# EAGLE design 9DofImu (EAGLE 7.5.0)

## Sheet 1 of 2
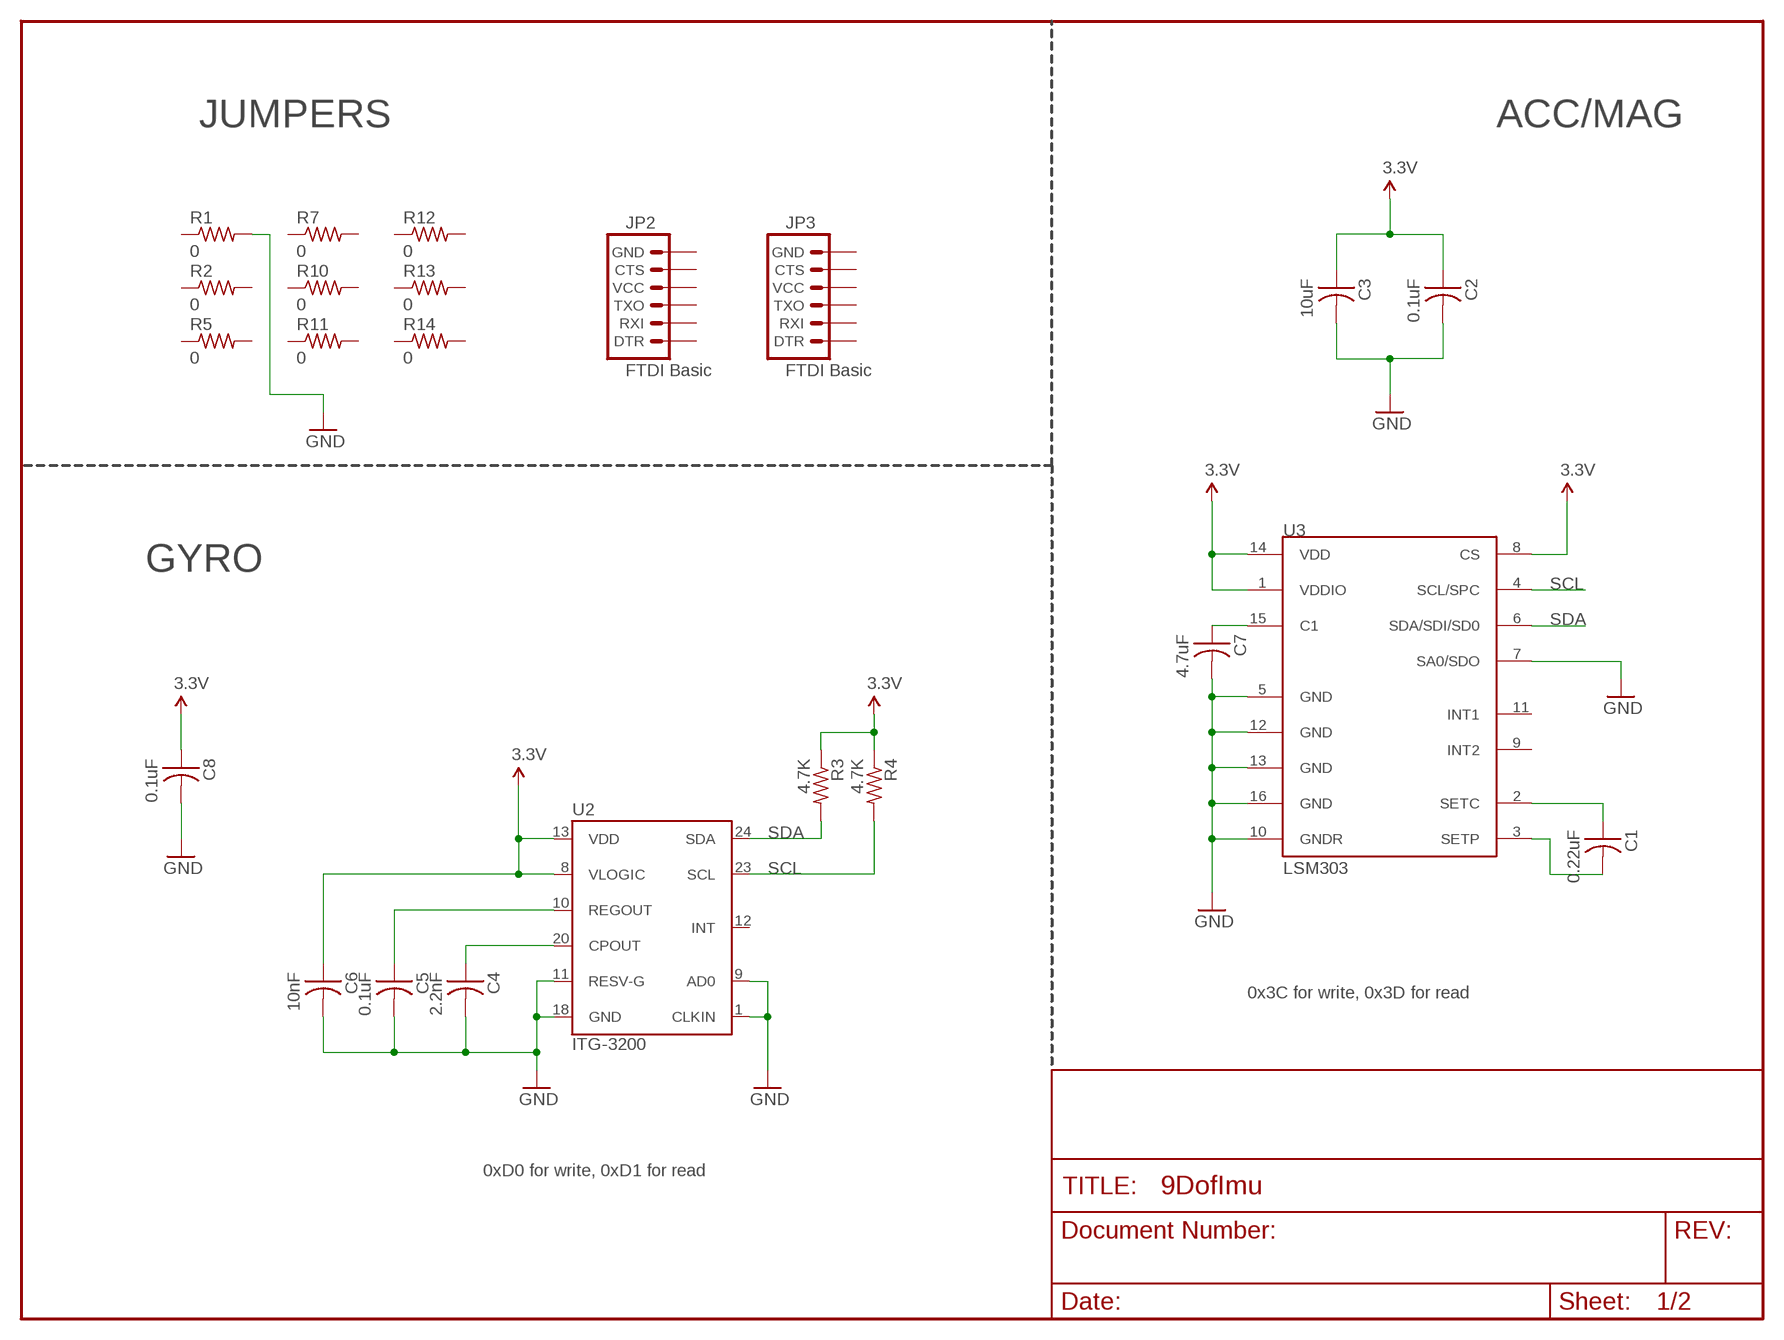
[diagram p0: schematic, sheet 1]

### Parts
C1  0.22uF  CAP-US1206  [C1206]
C2  0.1uF  CAP-US1206  [C1206]
C3  10uF  CAP-US1206  [C1206]
C4  2.2nF  CAP-US1206  [C1206]
C5  0.1uF  CAP-US1206  [C1206]
C6  10nF  CAP-US1206  [C1206]
C7  4.7uF  CAP-US1206  [C1206]
C8  0.1uF  CAP-US1206  [C1206]
JP2  FTDI Basic  ARDUINO_SERIAL_PROGRAMPTH-KIT  [1X06-KIT]
JP3  FTDI Basic  ARDUINO_SERIAL_PROGRAMPTH-KIT  [1X06-KIT]
R1  0  RES-US1206FAB  [R1206FAB]
R2  0  RES-US1206FAB  [R1206FAB]
R3  4.7K  RES-US1206  [R1206]
R4  4.7K  RES-US1206FAB  [R1206FAB]
R5  0  RES-US1206FAB  [R1206FAB]
R7  0  RES-US1206FAB  [R1206FAB]
R10  0  RES-US1206FAB  [R1206FAB]
R11  0  RES-US1206FAB  [R1206FAB]
R12  0  RES-US1206FAB  [R1206FAB]
R13  0  RES-US1206FAB  [R1206FAB]
R14  0  RES-US1206FAB  [R1206FAB]
U2  ITG-3200  [QFN-24]
U3  LSM303  [LGA16-3MM]

### Nets
3.3V: C2.1 C3.1 C6.1 C8.1 R3.1 R4.1 U2.8(VLOGIC) U2.13(VDD) U3.1(VDDIO) U3.8(CS) U3.14(VDD) ; also sheet 2
GND: C2.2 C3.2 C4.2 C5.2 C6.2 C7.2 C8.2 R1.2 U2.1(CLKIN) U2.9(AD0) U2.11(RESV-G) U2.18(GND) U3.5(GND) U3.7(SA0/SDO) U3.10(GNDR) U3.12(GND) U3.13(GND) U3.16(GND) ; also sheet 2
N$1: C4.1 U2.20(CPOUT)
N$2: C5.1 U2.10(REGOUT)
N$3: C7.1 U3.15(C1)
N$4: C1.1 U3.2(SETC)
N$5: C1.2 U3.3(SETP)
SCL: R4.2 U2.23(SCL) U3.4(SCL/SPC) ; also sheet 2
SDA: R3.2 U2.24(SDA) U3.6(SDA/SDI/SD0) ; also sheet 2
Unconnected: JP2.1(DTR) JP2.2(RXI) JP2.3(TXO) JP2.4(VCC) JP2.5(CTS) JP2.6(GND) JP3.1(DTR) JP3.2(RXI) JP3.3(TXO) JP3.4(VCC) JP3.5(CTS) JP3.6(GND) R1.1 R2.1 R2.2 R5.1 R5.2 R7.1 R7.2 R10.1 R10.2 R11.1 R11.2 R12.1 R12.2 R13.1 R13.2 R14.1 R14.2 U2.12(INT) U3.9(INT2) U3.11(INT1)

### Notes on the sheet
- JUMPERS | ACC/MAG
- GYRO
- 0x3C for write, 0x3D for read
- 0xD0 for write, 0xD1 for read

## Sheet 2 of 2
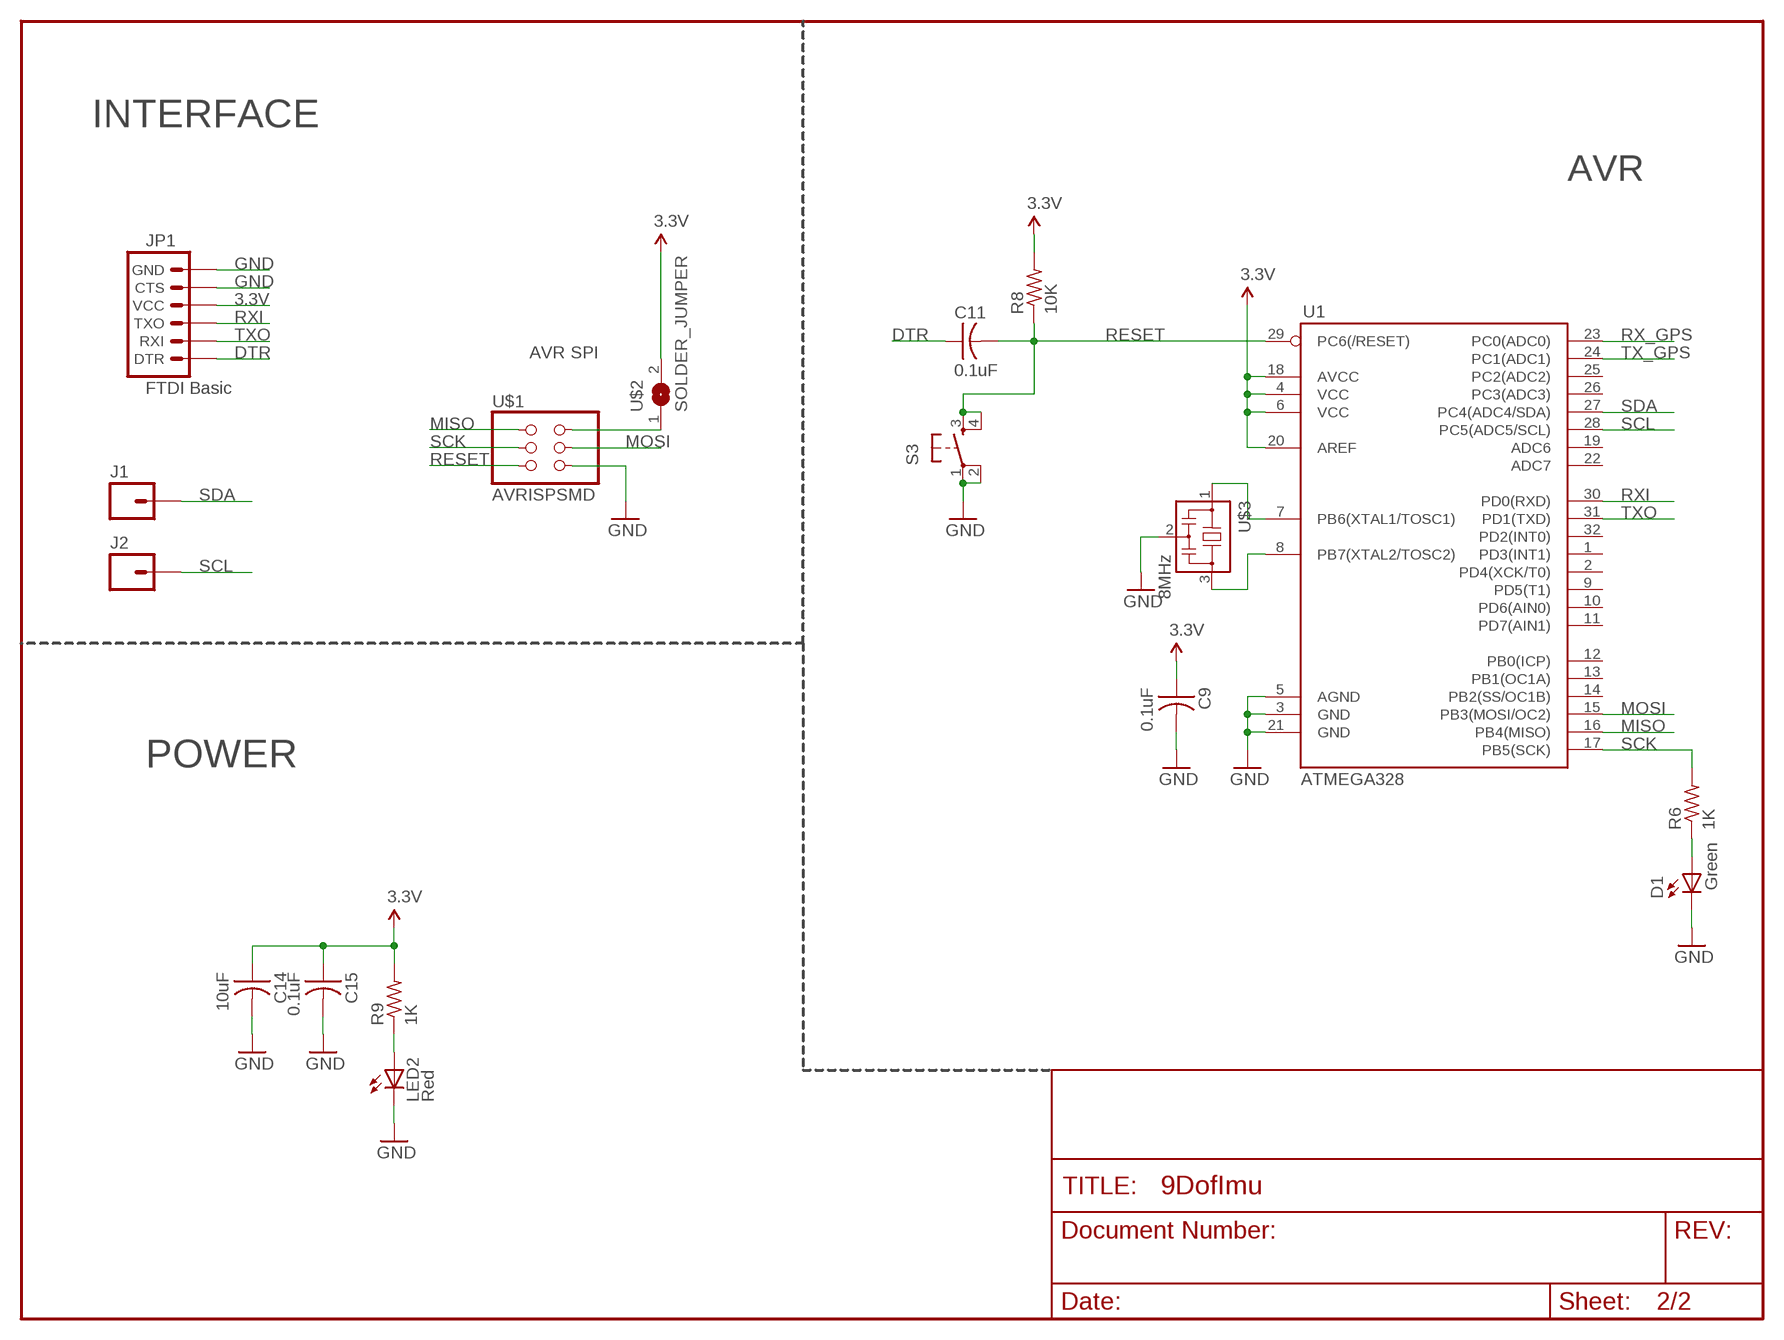
[diagram p1: schematic, sheet 2]

### Parts
C9  0.1uF  CAP-US1206  [C1206]
C11  0.1uF  CAP-US1206  [C1206]
C14  10uF  CAP-US1206  [C1206]
C15  0.1uF  CAP-US1206  [C1206]
D1  Green  LED1206  [LED-1206]
J1  M01PTH  [1X01]
J2  M01PTH  [1X01]
JP1  FTDI Basic  ARDUINO_SERIAL_PROGRAMPTH-KIT  [1X06-KIT]
LED2  Red  LED1206  [LED-1206]
R6  1K  RES-US1206  [R1206]
R8  10K  RES-US1206  [R1206]
R9  1K  RES-US1206FAB  [R1206FAB]
S3  6MM_SWITCH6MM_SWITCH  [6MM_SWITCH]
U1  ATMEGA328  ATMEGA168  [TQFP32-08]
U$1  AVRISPSMD  [2X03SMD]
U$2  SOLDER_JUMPER  [SJFAB]
U$3  8MHz  RESONATOR  [EFOBM]

### Nets
3.3V: C9.1 C14.1 C15.1 JP1.4(VCC) R8.2 R9.2 U1.4(VCC) U1.6(VCC) U1.18(AVCC) U1.20(AREF) U$2.2 ; also sheet 1
DTR: C11.1 JP1.1(DTR)
GND: C9.2 C14.2 C15.2 D1.C JP1.5(CTS) JP1.6(GND) LED2.C S3.1(P) S3.2(P1) U1.3(GND) U1.5(AGND) U1.21(GND) U$1.6(GND) U$3.2 ; also sheet 1
MISO: U1.16(PB4(MISO)) U$1.1(MISO)
MOSI: U1.15(PB3(MOSI/OC2)) U$1.4(MOSI)
N$6: LED2.A R9.1
N$7: U$1.2(VCC) U$2.1
N$8: D1.A R6.1
N$9: U1.8(PB7(XTAL2/TOSC2)) U$3.3
N$10: U1.7(PB6(XTAL1/TOSC1)) U$3.1
RESET: C11.2 R8.1 S3.3(S) S3.4(S1) U1.29(PC6(/RESET)) U$1.5(RST)
RX_GPS: U1.23(PC0(ADC0))
RXI: JP1.3(TXO) U1.30(PD0(RXD))
SCK: R6.2 U1.17(PB5(SCK)) U$1.3(SCK)
SCL: J2.1 U1.28(PC5(ADC5/SCL)) ; also sheet 1
SDA: J1.1 U1.27(PC4(ADC4/SDA)) ; also sheet 1
TX_GPS: U1.24(PC1(ADC1))
TXO: JP1.2(RXI) U1.31(PD1(TXD))
Unconnected: U1.1(PD3(INT1)) U1.2(PD4(XCK/T0)) U1.9(PD5(T1)) U1.10(PD6(AIN0)) U1.11(PD7(AIN1)) U1.12(PB0(ICP)) U1.13(PB1(OC1A)) U1.14(PB2(SS/OC1B)) U1.19(ADC6) U1.22(ADC7) U1.25(PC2(ADC2)) U1.26(PC3(ADC3)) U1.32(PD2(INT0))

### Notes on the sheet
- INTERFACE
- AVR
- AVR SPI
- POWER

## Library data of the parts
C1-C9 C11 C14 C15 = fab:CAP-US
D1 LED2 = SparkFun:LED: LEDs Standard schematic elements and footprints for 5mm, 3mm, 1206, and 0603 sized LEDs. 5mm - Spark Fun Electronics SKU : COM-00529 (and others)
J1 J2 = SparkFun-Connectors:M01: Header 1 Standard 1-pin 0.1" header. Use with straight break away headers (SKU : PRT-00116), right angle break away headers (PRT-00553), swiss pins (PRT-00743), machine pins (PRT-00117), and female headers (PRT-00115). SMTSO-256-ET is a "flush mount" nut for a 4-40 screw. The older package used to be too tight, and did not allow it to sit properly thru the drill hit. The latest (0.165DIA) fits nice and snug.
JP1-JP3 = SparkFun:ARDUINO_SERIAL_PROGRAM
R1-R14 = fab:RES-US: Resistor (US Symbol) Variants with postfix FAB are widened to allow the routing of internal traces
S3 = fab:6MM_SWITCH: OMRON SWITCH
U1 = SparkFun:ATMEGA168
U2 = amanda:ITG-3200: ITG-3200 3-axis gyro, digital output, qfn24 package
U3 = amanda:LSM303: LSM303 3-axis accelerometer and 3-axis magnetometer
U$1 = fab:AVRISP
U$2 = fab:SOLDER_JUMPER
U$3 = fab:RESONATOR

## Net classes
0 default: width 0.305 mm, clearance 0.457 mm

## Board
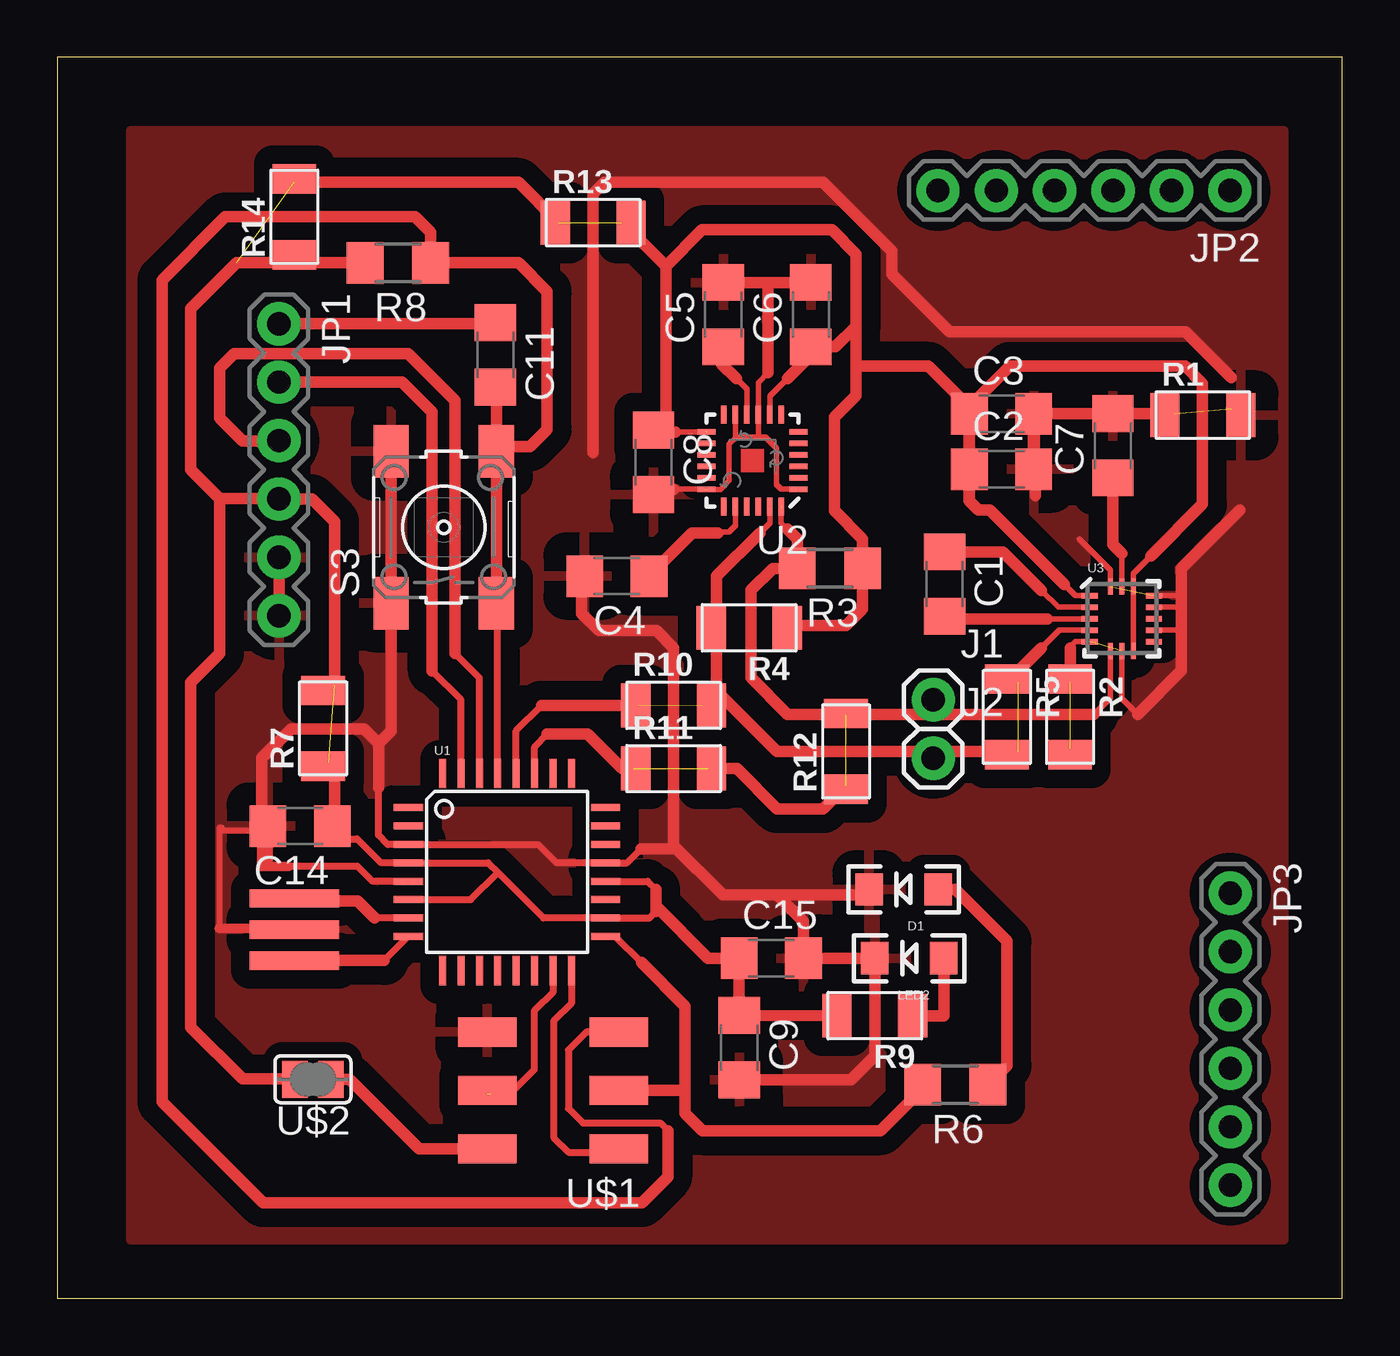
[diagram p2: board, top side]

Size 55.88 x 53.98 mm. Coordinates in mm from the lower left corner, seen from the top.
Outline: 0,0 55.88,0 55.88,53.98 0,53.98 0,0
Copper layers 1+16: Top 0.035mm / dielectric 1.5mm / Bottom 0.035mm
Design rules "fablab_10mil *": minimum track width 6mil, minimum drill 0.8mm, track to track 10.5mil, track to pad 10.5mil, pad to pad 10.5mil, via to via 10.5mil, smd to smd 10.5mil, copper to edge 10mil, drill to drill 10mil, minimum pad ring 0.8mm, minimum via ring 0.8mm, stop-mask expansion 4mil, vias tented up to drill 0mil, thermal gap 1mm

### Footprints (pad centres in the part's own frame; a part is rotated, then mirrored left to right if it is on the bottom)
C1206 = smd 1.6 x 1.8: 1 -1.4,0; 2 1.4,0
LED-1206 = smd 1.2 x 1.4: A -1.5,0; C 1.5,0
1X01 = drill 1.016 pad 1.88: 1 0,0
1X06-KIT = drill 1.016 pad 1.88: 1 0,0; 2 2.54,0; 3 5.08,0; 4 7.62,0; 5 10.16,0; 6 12.7,0
R1206FAB = smd 1.27 x 1.905: 1 -1.651,0; 2 1.651,0
R1206 = smd 1.6 x 1.803: 1 -1.422,0; 2 1.422,0
6MM_SWITCH = smd 2.286 x 1.524: 1 -3.302,2.286; 2 3.302,2.286; 3 -3.302,-2.286; 4 3.302,-2.286
TQFP32-08 = smd 1.27 x 0.305: 1 -4.293,2.8; 2 -4.293,2; 3 -4.293,1.2; 4 -4.293,0.4; 5 -4.293,-0.4; 6 -4.293,-1.2; 7 -4.293,-2; 8 -4.293,-2.8; 17 4.293,-2.8; 18 4.293,-2; 19 4.293,-1.2; 20 4.293,-0.4; 21 4.293,0.4; 22 4.293,1.2; 23 4.293,2; 24 4.293,2.8 | smd 0.305 x 1.27: 9 -2.8,-4.293; 10 -2,-4.293; 11 -1.2,-4.293; 12 -0.4,-4.293; 13 0.4,-4.293; 14 1.2,-4.293; 15 2,-4.293; 16 2.8,-4.293; 25 2.8,4.293; 26 2,4.293; 27 1.2,4.293; 28 0.4,4.293; 29 -0.4,4.293; 30 -1.2,4.293; 31 -2,4.293; 32 -2.8,4.293
QFN-24 = smd 0.8 x 0.229: 1 -2,1.25; 2 -2,0.75; 3 -2,0.25; 4 -2,-0.25; 5 -2,-0.75; 6 -2,-1.25; 13 2,-1.25; 14 2,0.25; 15 2,-0.25; 16 2,-0.75; 17 2,0.75; 18 2,1.25 | smd 0.229 x 0.8: 7 -1.25,-2; 8 -0.75,-2; 9 -0.25,-2; 10 0.25,-2; 11 0.75,-2; 12 1.25,-2; 19 -0.25,2; 20 0.75,2; 21 0.25,2; 22 1.25,2; 23 -0.75,2; 24 -1.25,2
LGA16-3MM = smd 0.7 x 0.229: 1 -1.4,1; 2 -1.4,0.5; 3 -1.4,0; 4 -1.4,-0.5; 5 -1.4,-1; 9 1.4,-1; 10 1.4,-0.5; 11 1.4,0; 12 1.4,0.5; 13 1.4,1 | smd 0.229 x 0.7: 6 -0.5,-1.4; 7 0,-1.4; 8 0.5,-1.4; 14 0.5,1.4; 15 0,1.4; 16 -0.5,1.4
2X03SMD = smd 2.54 x 1.27: 1 -2.857,2.54; 2 2.857,2.54; 3 -2.857,0; 4 2.857,0; 5 -2.857,-2.54; 6 2.857,-2.54
SJFAB = smd 1.118 x 1.6: 1 -0.787,0; 2 0.787,0
EFOBM = smd 0.8 x 3.9: 1 -1.35,0; 2 0,0; 3 1.35,0

### Placement (x,y rotation side)
C1  38.59,31.07 270 top
C2  41.07,36.06 0 top
C3  41.07,38.47 0 top
C4  24.34,31.41 180 top
C5  28.96,42.79 90 top
C6  32.77,42.79 90 top
C7  45.91,37.08 90 top
C8  25.93,36.36 270 top
C9  29.66,10.9 270 top
C11  19.05,41.04 270 top
C14  10.55,20.54 180 top
C15  31.05,14.79 0 top
D1  36.8,17.79 180 top
J1  38.1,26.04 0 top
J2  38.1,23.49 0 top
JP1  9.63,42.39 270 top
JP2  51,48.18 180 top
JP3  51.02,17.62 270 top
LED2  37.05,14.79 180 top
R1  49.82,38.41 0 top
R2  44.05,25.29 270 top
R3  33.6,31.75 180 top
R4  30.09,29.16 180 top
R5  41.3,25.29 270 top
R6  39.05,9.29 180 top
R7  11.55,24.79 90 top
R8  14.8,45.04 180 top
R9  35.55,12.29 180 top
R10  26.8,25.79 0 top
R11  26.8,23.04 0 top
R12  34.3,23.79 90 top
R13  23.3,46.79 0 top
R14  10.3,47.04 90 top
S3  16.8,33.54 90 top
U1  19.55,18.54 0 top
U2  30.23,36.44 180 top
U3  46.3,29.56 0 top
U$1  21.55,9.04 180 top
U$2  11.11,9.53 180 top
U$3  10.3,16.04 270 top

### Tracks (layer width: path | path; a pad name or v marks a point on that pad's centre or on a via)
3.3V  (4 unrouted)
  Top 0.229: 47.55,32.29 46.8,31.54 U3.14 U3.8 | U3.1 44.28,30.56 43.8,31.04 | U2.13 26.89,37.69 | 26.89,37.69 | 30.98,38.98 U2.8 30.98,39.24 31.75,40.01
  Top 0.305: 11.95,19.99 13.03,19.99 14.08,18.94 U1.4 18.74,18.94 19.16,18.52 | 19.16,18.52 21.14,16.54 U1.18 25.75,16.54 26.04,16.83 26.04,17.06 | U1.6 17.98,17.34 19.16,18.52 | U1.20 25.68,18.14 26.04,17.78
  Top 0.457: C2.1 C3.1
  Top 0.508: 34.74,42.28 34.74,45.42 33.69,46.48 28.04,46.48 26.47,44.9 | 34.74,42.28 33.85,41.39 C6.1 32.77,41.03 31.75,40.01 | 26.89,37.69 26.54,37.69 26.47,37.77 | 26.47,37.77 C8.1 | 26.47,44.9 26.47,37.77 | 34.74,40.54 34.74,39.27 33.79,38.32 33.79,34.26 35.03,33.02 R3.1 35.03,29.99 34.3,29.27 31.62,29.27 R4.1 | 34.74,40.54 34.74,42.28 | 39.67,34.68 40.05,34.29 40.55,34.29 43.8,31.04 | 39.67,34.68 C2.1 39.67,38.38 39.73,38.44 39.73,38.84 41.43,40.54 49.05,40.54 49.8,39.79 49.8,34.54 47.55,32.29 | 39.67,34.68 39.65,34.7 39.65,38.79 37.9,40.54 34.74,40.54 | 11.95,19.99 C14.1 12.05,20.64 12.05,22.79 11.8,23.04 11.8,23.29 | 7.05,34.79 9.54,34.79 JP1.4 11.07,34.77 12.05,33.79 12.05,26.68 12.07,26.67 | 7.05,34.79 5.8,36.04 5.8,43.04 7.8,45.04 R8.2 | R9.2 C9.1 29.66,12.34 C15.1 28.3,14.79 26.04,17.06 | 7.05,34.79 7.05,28.04 5.8,26.79 5.8,11.79 8.05,9.54 U$2.2 | 26.47,44.9 24.8,46.56 24.8,47.04 24.55,46.79 | 21.8,46.79 20.05,48.54 10.3,48.54 | 26.04,16.83 26.04,17.78
DTR
  Top 0.508: C11.1 19,42.39 JP1.1
GND  (8 unrouted)
  Top 0.229: U3.16 45.8,31.67 44.45,33.02 | U3.5 44.28,28.56 44.05,28.33 | U3.13 48.81,30.56 48.89,30.48 | U3.10 48.74,29.06 48.89,29.21 | U3.12 48.68,30.06 48.89,29.84 | U3.7 46.3,26.09 46.99,25.4 | U2.18 28.84,35.19 29.21,35.56 29.21,37.15 29.53,37.46 | 29.53,37.46 30.48,37.46 | 30.48,37.46 30.8,37.46 31.27,36.99 31.27,35.4 31.43,35.24 31.48,35.19 U2.1 | U2.18 26.8,35.19 | U2.11 29.48,37.51 29.53,37.46 | 30.48,37.46 30.48,37.47 U2.9 30.48,39.83 30.91,40.26
  Top 0.25: 44.05,28.33 44.05,28.29
  Top 0.254: 48.68,30.06 48.89,30.06 48.89,30.48 | 51.05,38.7 51.48,38.7 R1.2 | 8.89,20.32 7.15,20.32 7.15,20.46 7.04,20.46 7.04,16.08
  Top 0.305: U1.5 13.7,18.14 13.05,18.79 10.05,18.79 | 13.97,22.22 13.96,22.22 13.96,20.15 14.37,19.74 U1.3 20.9,19.74 21.7,18.94 U1.21 24.78,18.94 25.38,19.54
  Top 0.406: 10.05,18.79 9.09,18.79 | 9.09,18.79 9.09,19.02 9.16,19.02 C14.2 | 9.09,18.79 8.89,18.79 8.89,20.32 | 7.04,16.08 10.3,16.08 U$3.2
  Top 0.457: C2.2 C3.2
  Top 0.508: C6.2 30.91,44.19 | 30.91,44.19 C5.2 | 30.91,40.26 30.91,44.19 | 26.8,35.19 26.79,35.19 26.39,35.19 26.17,34.96 | C3.2 42.48,38.48 C7.2 | C2.2 42.54,35.98 42.54,34.92 | C2.2 42.46,38.54 42.51,38.48 48.59,38.48 48.59,38.49 | C2.2 42.49,36.1 42.49,38.63 42.64,38.48 48.45,38.48 48.46,38.49 | 51.25,38.48 51.3,38.54 | 51.43,38.32 51.05,38.7 | 23.3,36.79 23.3,48.04 23.8,48.54 33.3,48.54 36.3,45.54 36.3,44.54 38.8,42.04 49.05,42.04 51.05,40.04 | 44.05,28.29 44.05,26.79 | 9.16,19.69 C14.2 8.89,20.8 8.89,23.49 10.16,24.77 13.34,24.77 13.97,24.13 | 25.38,19.54 26.8,19.54 26.8,19.68 | S3.2 S3.1 14.52,24.68 13.97,24.13 | 8.96,29.69 JP1.6 JP1.5 | 31.3,17.54 28.95,17.54 26.8,19.68 | 31.3,17.54 32.45,16.39 C15.2 LED2.C 35.55,10.54 34.52,9.5 C9.2 | 22.8,31.84 22.8,29.79 23.55,29.04 26.05,29.04 26.8,28.29 26.8,19.68 | 13.97,24.13 13.97,22.22 | 44.05,23.89 44.45,23.49 | 51.43,34.29 48.89,31.75 48.89,30.48 48.89,29.21 48.89,27.3 46.99,25.4 | 31.3,17.54 35.05,17.54 D1.C
  pour Top (isolate 0.813): 3.17,50.8 3.17,2.54 53.34,2.54 53.34,50.8
MISO
  Top 0.305: U1.16 22.36,12.83 21.59,12.07 21.59,6.99 22.23,6.35 24.26,6.35 U$1.1
  Top 0.508: 24.06,6.5 U$1.1
MOSI  (1 unrouted)
  Top 0.305: U1.15 21.55,13.3 20.74,12.49 20.74,9.94 19.69,8.89 18.85,8.89
  Top 0.406: 18.7,8.89 U$1.4
N$1  (1 unrouted)
  Top 0.229: U2.20 29.49,33.62 29.21,33.34 28.78,33.34 28.72,33.28
  Top 0.508: C4.1 27.61,33.28 28.72,33.28
N$2
  Top 0.229: U2.10 29.98,39.55 29.53,40.01
  Top 0.508: 29.53,40.01 28.89,40.64 28.89,41.32 C5.1
N$3
  Top 0.229: U3.15 46.3,32.38 46.3,32.44
  Top 0.508: C7.1 45.91,32.78 46.3,32.38
N$4
  Top 0.229: U3.2 43.53,30.06 42.8,30.79
  Top 0.508: 42.8,30.79 41.13,32.47 C1.1
N$5  (1 unrouted)
  Top 0.229: 44.88,29.54 43.05,29.54
  Top 0.508: 43.05,29.54 40.8,29.54 38.54,29.55 C1.2
N$6
  Top 0.508: LED2.A 38.55,12.29 R9.1
N$7
  Top 0.508: U$2.1 12.7,9.53 15.73,6.5 U$1.2
N$8
  Top 0.508: R6.1 41.3,10.12 41.3,15.54 39.05,17.79 D1.A
N$9
  Top 0.305: U1.8 14.21,14.69
  Top 0.508: 14.21,14.69 U$3.3
N$10
  Top 0.305: U1.7 13.8,16.54
  Top 0.508: 13.8,16.54 13.05,17.29 11.55,17.29 11.45,17.39 U$3.1
RESET
  Top 0.305: U1.29 19.16,29.68 | U$1.5 23.01,11.58 22.23,10.8 22.23,8.25 22.86,7.62 26.23,7.62 26.55,7.29
  Top 0.508: S3.4 S3.3 19.09,29.75 19.16,29.68 | C11.2 19.09,39.6 S3.4 | S3.4 19.29,37.04 20.55,37.04 21.3,37.79 21.3,43.79 20.05,45.04 R8.1 16.23,46.37 15.55,47.04 7.3,47.04 4.55,44.29 4.55,8.54 8.94,4.16 25.42,4.16 26.55,5.29 26.55,7.29
RXI
  Top 0.305: U1.30 18.36,26.99 17.3,28.04
  Top 0.508: 17.3,28.04 17.3,39.04 15.25,41.09 7.69,41.09 7.05,40.46 7.05,38.29 8.05,37.29 9.05,37.29 9.07,37.31 JP1.3
SCK
  Top 0.305: U1.17 24.27,15.74 25.4,14.61
  Top 0.508: 27.3,9.04 27.3,12.7 25.4,14.61 | U$1.3 27.3,9.04 | 27.3,9.04 27.3,8.04 28.05,7.29 29.85,7.29 35.8,7.29 37.63,9.12 R6.2
SCL  (3 unrouted)
  Top 0.229: U3.4 43.57,29.06 42.8,28.29 | U2.23 30.99,33.73 30.55,33.29
  Top 0.25: 30.55,33.29
  Top 0.305: U1.28 19.96,24.69 21.05,25.79 | J2.1 38.1,23.79
  Top 0.508: 30.55,33.29 28.67,31.41 28.67,29.39 R4.2 28.67,28.93 28.67,26.43 | 41.8,26.79 41.8,27.29 42.8,28.29 | 41.8,23.79 38.1,23.79 31.3,23.79 28.67,26.43 | 28.67,26.43 28.05,25.81 28.05,25.54 | 25.3,25.79 21.05,25.79
SDA  (3 unrouted)
  Top 0.229: U3.6 45.8,26.11 45.08,25.4 | U2.24 31.48,33.73 31.75,33.46
  Top 0.305: U1.27 20.75,23.99 21.3,24.54 | J1.1 38.1,25.4
  Top 0.508: 31.75,33.46 32.18,33.03 R3.2 31.12,31.75 30.17,30.8 30.17,26.99 31.75,25.4 34.29,25.4 | 34.3,22.29 33.3,21.29 31.3,21.29 29.55,23.04 28.3,23.04 | 21.3,24.54 23.05,24.54 24.55,23.04 25.05,23.04 | 34.3,25.38 34.29,25.4 | 34.29,25.4 38.1,25.4 45.08,25.4
TXO
  Top 0.305: U1.31 17.55,26.04 16.3,27.29
  Top 0.508: 16.3,27.29 16.3,38.54 15,39.85 JP1.2